# EAGLE design LichtschrankenArray (EAGLE 9.6.2)
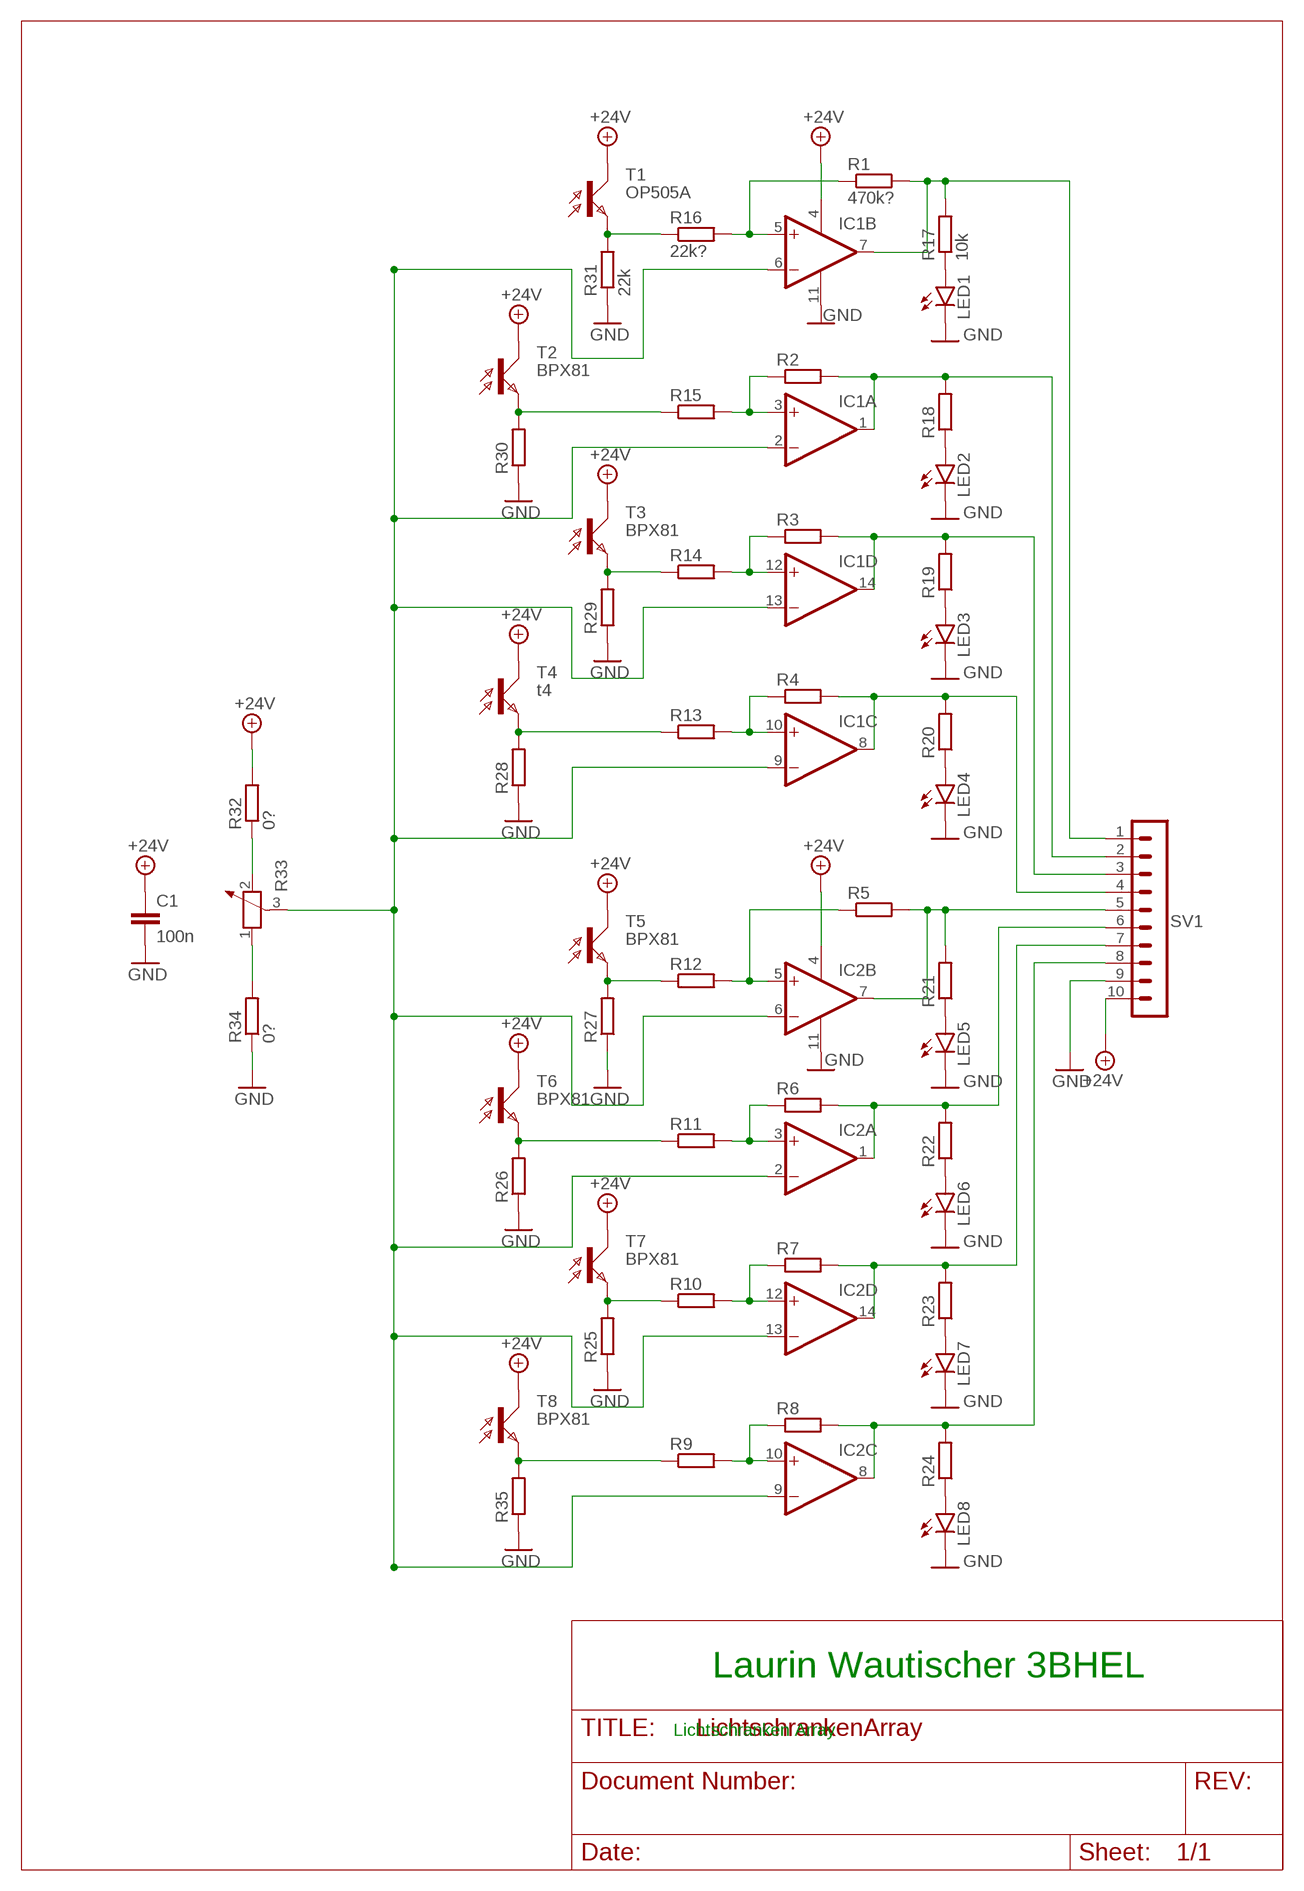
[diagram p0: schematic, sheet 1]

## Parts
C1  100n  C-EUC1206  [C1206]
IC1  4AMP_P4+11N  [DIL14]
IC2  4AMP_P4+11N  [DIL14]
LED1  LEDSMT1206  [1206]
LED2  LEDSMT1206  [1206]
LED3  LEDSMT1206  [1206]
LED4  LEDSMT1206  [1206]
LED5  LEDSMT1206  [1206]
LED6  LEDSMT1206  [1206]
LED7  LEDSMT1206  [1206]
LED8  LEDSMT1206  [1206]
R1  470k?  R-EU_0207/10  [0207/10]
R2  R-EU_0207/10  [0207/10]
R3  R-EU_0207/10  [0207/10]
R4  R-EU_0207/10  [0207/10]
R5  R-EU_0207/10  [0207/10]
R6  R-EU_0207/10  [0207/10]
R7  R-EU_0207/10  [0207/10]
R8  R-EU_0207/10  [0207/10]
R9  R-EU_R1206  [R1206]
R10  R-EU_R1206  [R1206]
R11  R-EU_R1206  [R1206]
R12  R-EU_R1206  [R1206]
R13  R-EU_R1206  [R1206]
R14  R-EU_R1206  [R1206]
R15  R-EU_R1206  [R1206]
R16  22k?  R-EU_R1206  [R1206]
R17  10k  R-EU_0207/10  [0207/10]
R18  R-EU_0207/10  [0207/10]
R19  R-EU_0207/10  [0207/10]
R20  R-EU_0207/10  [0207/10]
R21  R-EU_0207/10  [0207/10]
R22  R-EU_0207/10  [0207/10]
R23  R-EU_0207/10  [0207/10]
R24  R-EU_0207/10  [0207/10]
R25  R-EU_0207/10  [0207/10]
R26  R-EU_0207/10  [0207/10]
R27  R-EU_0207/10  [0207/10]
R28  R-EU_0207/10  [0207/10]
R29  R-EU_0207/10  [0207/10]
R30  R-EU_0207/10  [0207/10]
R31  22k  R-EU_0207/10  [0207/10]
R32  0?  R-EU_0207/10  [0207/10]
R33  POTENTIOMETER_PT-10  [PT-10]
R34  0?  R-EU_0207/10  [0207/10]
R35  R-EU_0207/10  [0207/10]
SV1  MA10-1  [MA10-1]
T1  OP505A  BPX81  [BPX81]
T2  BPX81  [BPX81]
T3  BPX81  [BPX81]
T4  t4  BPX81  [BPX81]
T5  BPX81  [BPX81]
T6  BPX81  [BPX81]
T7  BPX81  [BPX81]
T8  BPX81  [BPX81]

## Nets
+24V: C1.1 IC1.4(P:V+) IC2.4(P:V+) R32.2 SV1.10 T1.C T2.C T3.C T4.C T5.C T6.C T7.C T8.C
GND: C1.2 IC1.11(P:V-) IC2.11(P:V-) LED1.C LED2.C LED3.C LED4.C LED5.C LED6.C LED7.C LED8.C R25.1 R26.1 R27.1 R28.1 R29.1 R30.1 R31.1 R34.1 R35.1 SV1.9
N$1: IC1.5(B:+IN) R1.1 R16.2
N$2: IC2.5(B:+IN) R5.1 R12.2
N$3: IC1.7(B:OUT) R1.2 R17.2 SV1.1
N$4: LED1.A R17.1
N$5: LED2.A R18.1
N$6: IC1.3(A:+IN) R2.1 R15.2
N$7: IC1.1(A:OUT) R2.2 R18.2 SV1.2
N$8: LED3.A R19.1
N$9: IC1.12(D:+IN) R3.1 R14.2
N$10: IC1.14(D:OUT) R3.2 R19.2 SV1.3
N$11: LED4.A R20.1
N$12: IC1.10(C:+IN) R4.1 R13.2
N$13: IC1.8(C:OUT) R4.2 R20.2 SV1.4
N$14: LED5.A R21.1
N$15: LED6.A R22.1
N$16: IC2.3(A:+IN) R6.1 R11.2
N$17: IC2.1(A:OUT) R6.2 R22.2 SV1.6
N$18: LED7.A R23.1
N$19: IC2.12(D:+IN) R7.1 R10.2
N$20: IC2.14(D:OUT) R7.2 R23.2 SV1.7
N$21: LED8.A R24.1
N$22: IC2.10(C:+IN) R8.1 R9.2
N$23: IC2.8(C:OUT) R8.2 R24.2 SV1.8
N$24: IC2.7(B:OUT) R5.2 R21.2 SV1.5
N$26: R14.1 R29.2 T3.E
N$27: R12.1 R27.2 T5.E
N$28: R10.1 R25.2 T7.E
N$29: R9.1 R35.2 T8.E
N$31: R13.1 R28.2 T4.E
N$32: R15.1 R30.2 T2.E
N$33: R16.1 R31.2 T1.E
N$35: IC1.2(A:-IN) IC1.6(B:-IN) IC1.9(C:-IN) IC1.13(D:-IN) IC2.2(A:-IN) IC2.6(B:-IN) IC2.9(C:-IN) IC2.13(D:-IN) R33.3
N$36: R11.1 R26.2 T6.E
N$38: R32.1 R33.2
N$39: R33.1 R34.2

## Notes on the sheet
- Laurin Wautischer 3BHEL
- Lichtschranken Array

## Library data of the parts
C1 = rcl:C-EU: CAPACITOR, European symbol; SPICEPREFIX: C
IC1 IC2 = linear:4AMP_P4+11: OP AMP
LED1-LED8 = led:LED: LED OSRAM: - CHIPLED LG R971, LG N971, LY N971, LG Q971, LY Q971, LO R971, LY R971 LH N974, LH R974 LS Q976, LO Q976, LY Q976 LO Q996 - Hyper CHIPLED LW Q18S LB Q993, LB Q99A, LB R99A - SideLED LS A670, LO A670, LY A670, LG A670, LP A670 LB A673, LV A673, LT A673, LW A673 LH A674 LY A675 LS A676, LA A676, LO A676, LY A676, LW A676 LS A679, LY A679, LG A679 - Hyper Micro SIDELED® LS Y876, LA Y876, LO Y876, LY Y876 LT Y87S - SmartLED LW L88C, LW L88S LB L89C, LB L89S, LG L890 LS L89K, LO L89K, LY L89K LS L896, LA L896, LO L896, LY L896 - TOPLED LS T670, LO T670, LY T670, LG T670, LP T670 LSG T670, LSP T670, LSY T670, LOP T670, LYG T670 LG T671, LOG T671, LSG T671 LB T673, LV T673, LT T673, LW T673 LH T674 LS T676, LA T676, LO T676, LY T676, LB T676, LH T676, LSB T676, LW T676 LB T67C, LV T67C, LT T67C, LS T67K, LO T67K, LY T67K, LW E67C LS E67B, LA E67B, LO E67B, LY E67B, LB E67C, LV E67C, LT E67C LW T67C LS T679, LY T679, LG T679 LS T770, LO T770, LY T770, LG T770, LP T770 LB T773, LV T773, LT T773, LW T773 LH T774 LS E675, LA E675, LY E675, LS T675 LS T776, LA T776, LO T776, LY T776, LB T776 LHGB T686 LT T68C, LB T68C - Hyper Mini TOPLED® LB M676 - Mini TOPLED Santana® LG M470 LS M47K, LO M47K, LY M47K Source: http://www.osram.convergy.de LUXEON: - LUMILED® LXK2-PW12-R00, LXK2-PW12-S00, LXK2-PW14-U00, LXK2-PW14-V00 LXK2-PM12-R00, LXK2-PM12-S00, LXK2-PM14-U00 LXK2-PE12-Q00, LXK2-PE12-R00, LXK2-PE12-S00, LXK2-PE14-T00, LXK2-PE14-U00 LXK2-PB12-K00, LXK2-PB12-L00, LXK2-PB12-M00, LXK2-PB14-N00, LXK2-PB14-P00, LXK2-PB14-Q00 LXK2-PR12-L00, LXK2-PR12-M00, LXK2-PR14-Q00, LXK2-PR14-R00 LXK2-PD12-Q00, LXK2-PD12-R00, LXK2-PD12-S00 LXK2-PH12-R00, LXK2-PH12-S00 LXK2-PL12-P00, LXK2-PL12-Q00, LXK2-PL12-R00 Source: www.luxeon.com KINGBRIGHT: KA-3528ASYC Source: www.kingbright.com
R1-R32 R34 R35 = rcl:R-EU_: RESISTOR, European symbol; SPICEPREFIX: R
R33 = rcl:POTENTIOMETER_: Potentiometer; SPICEMODEL: POT; SPICEPREFIX: X
SV1 = con-lstb:MA10-1: PIN HEADER; OC_FARNELL: unknown; OC_NEWARK: unknown
T1-T8 = opto-trans-siemens:BPX81: PHOTO TRANSISTOR; OC_FARNELL: unknown; OC_NEWARK: unknown

## Board
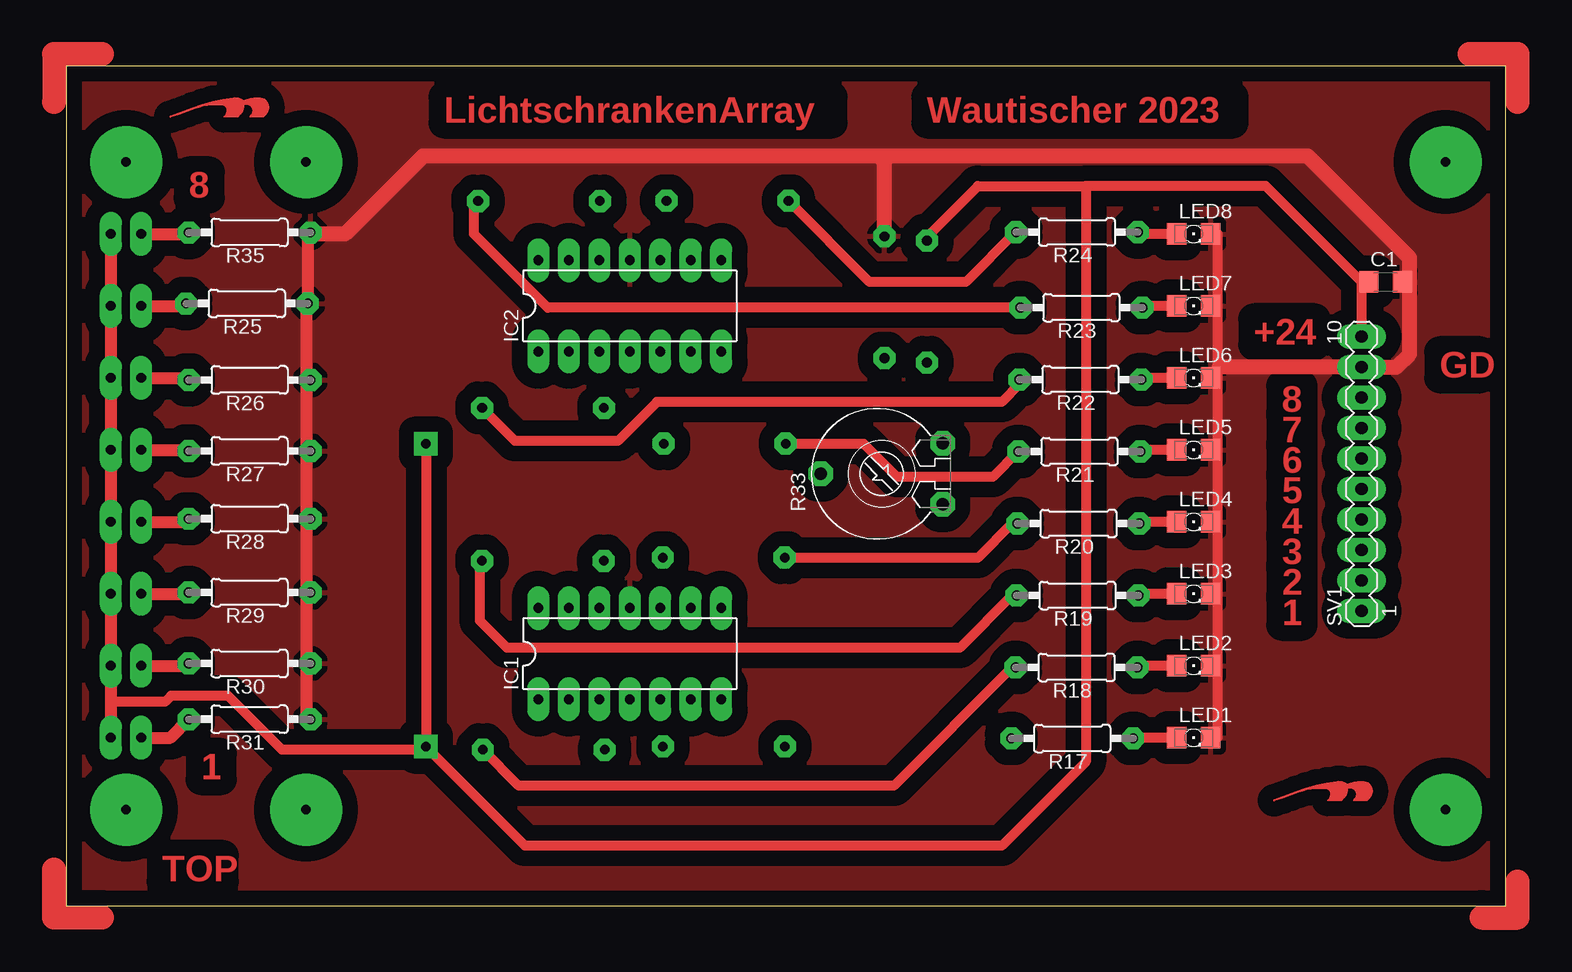
[diagram p1: board, top side]
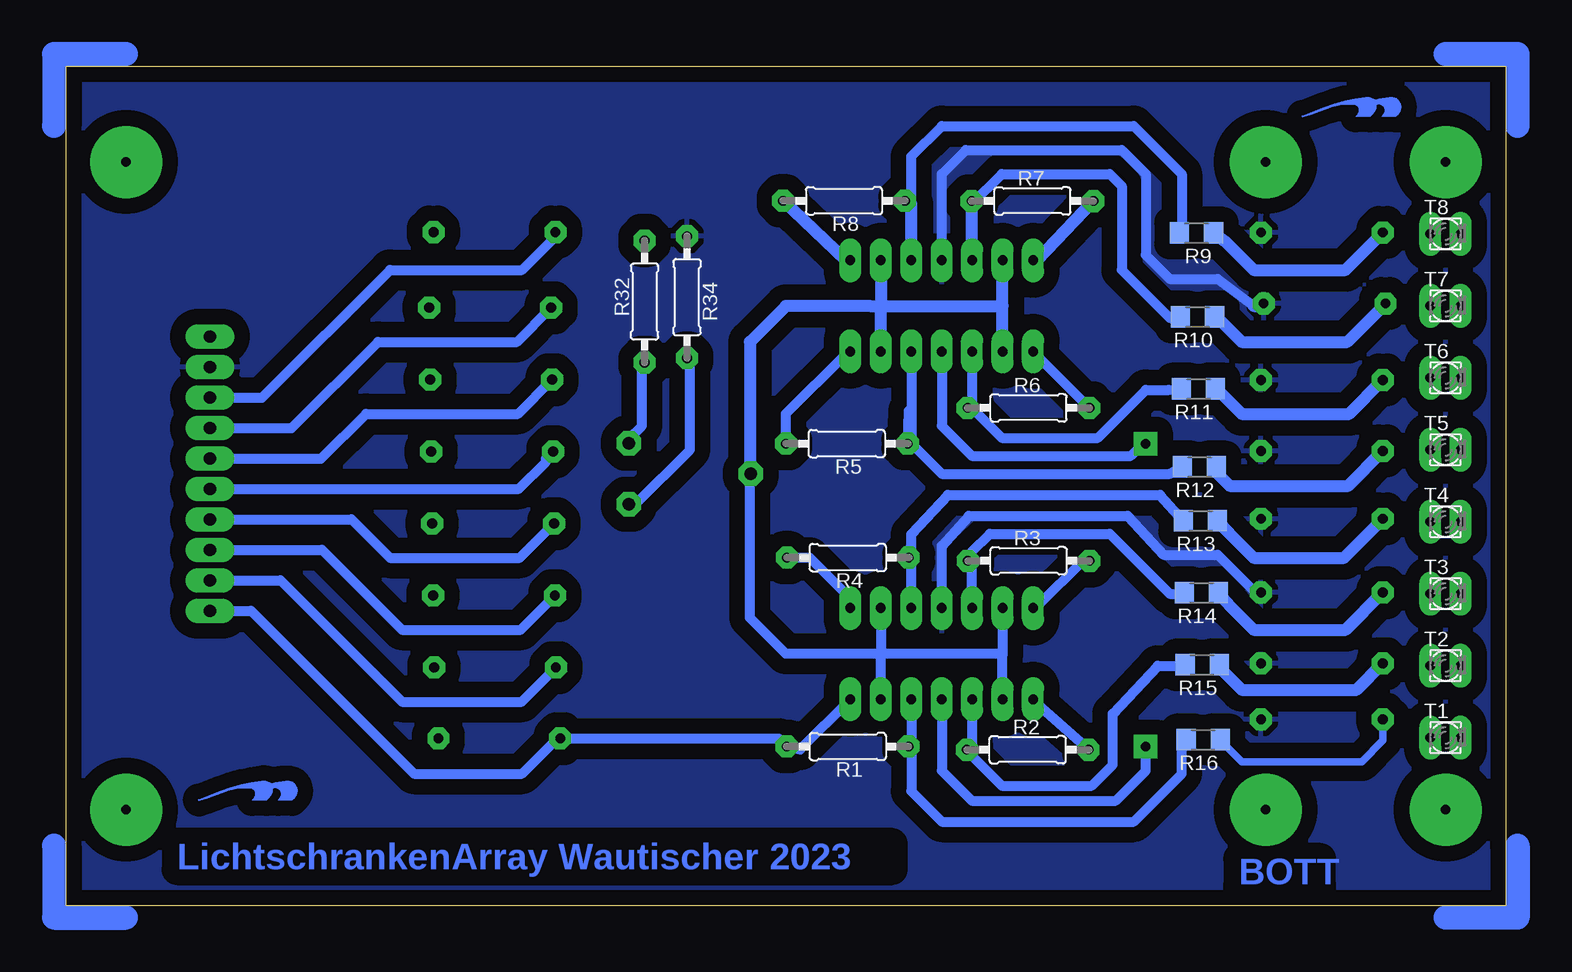
[diagram p2: board, bottom side, seen from below]

Size 120 x 70 mm. Coordinates in mm from the lower left corner, seen from the top.
Outline: 0,0 120,0 120,70 0,70 0,0
Copper layers (1*16): Top 0.035mm / dielectric 1.5mm / Bottom 0.035mm
Design rules "HTL-KLU-DRC *": minimum track width 16mil, minimum drill 31mil, track to track 16mil, track to pad 16mil, pad to pad 16mil, via to via 16mil, smd to smd 12mil, copper to edge 40mil, drill to drill 16mil, minimum pad ring 20mil, minimum via ring 16mil, stop-mask expansion 4mil, vias tented up to drill 0mil, thermal gap 20mil

### Footprints (pad centres in the part's own frame; a part is rotated, then mirrored left to right if it is on the bottom)
C1206 = smd 1.6 x 1.8: 1 -1.4,0; 2 1.4,0
DIL14 = drill 0.813 long: 1 -7.62,-3.81; 2 -5.08,-3.81; 3 -2.54,-3.81; 4 0,-3.81; 5 2.54,-3.81; 6 5.08,-3.81; 7 7.62,-3.81; 8 7.62,3.81; 9 5.08,3.81; 10 2.54,3.81; 11 0,3.81; 12 -2.54,3.81; 13 -5.08,3.81; 14 -7.62,3.81
1206 = smd 1.6 x 1.803: A -1.422,0; C 1.422,0
0207/10 = drill 0.813 octagon: 1 -5.08,0; 2 5.08,0
R1206 = smd 1.6 x 1.803: 1 -1.422,0; 2 1.422,0
PT-10 = drill 1.016 pad 1.778 octagon: 1 -2.54,-5.08; 2 2.54,-5.08; 3 0,5.08
MA10-1 = drill 1.016 long: 1 -11.43,0; 2 -8.89,0; 3 -6.35,0; 4 -3.81,0; 5 -1.27,0; 6 1.27,0; 7 3.81,0; 8 6.35,0; 9 8.89,0; 10 11.43,0
BPX81 = drill 0.813 long: C 1.27,0; E -1.27,0

### Placement (x,y rotation side)
C1  110,52 0 top
IC1  47,21 0 top
IC2  47,50 0 top
LED1  94,14 0 top
LED2  94,20 0 top
LED3  94,26 0 top
LED4  94,32 0 top
LED5  94,38 0 top
LED6  94,44 0 top
LED7  94,50 0 top
LED8  94,56 0 top
R1  54.84,13.26 180 bottom
R2  39.83,12.99 0 bottom
R3  39.75,28.74 0 bottom
R4  54.83,29.01 180 bottom
R5  54.91,38.51 180 bottom
R6  39.76,41.49 0 bottom
R7  39.43,58.74 0 bottom
R8  55.15,58.76 180 bottom
R9  25.76,56.07 180 bottom
R10  25.68,49.07 180 bottom
R11  25.6,43.07 180 bottom
R12  25.52,36.57 180 bottom
R13  25.44,32.07 180 bottom
R14  25.36,26.07 180 bottom
R15  25.28,20.07 180 bottom
R16  25.2,13.82 180 bottom
R17  83.88,13.93 180 top
R18  84.24,19.85 180 top
R19  84.32,25.85 180 top
R20  84.4,31.85 180 top
R21  84.48,37.85 180 top
R22  84.56,43.85 180 top
R23  84.64,49.85 180 top
R24  84.28,56.15 180 top
R25  15.08,50.2 180 top
R26  15.3,43.82 180 top
R27  15.3,37.9 180 top
R28  15.3,32.25 180 top
R29  15.3,26.1 180 top
R30  15.3,20.18 180 top
R31  15.3,15.53 180 top
R32  71.77,50.36 90 bottom
R33  68,36 90 top
R34  68.23,50.72 270 bottom
R35  15.3,56.12 180 top
SV1  108,36 90 top
T1  5,14 0 bottom
T2  5,20 0 bottom
T3  5,26 0 bottom
T4  5,32 0 bottom
T5  5,38 0 bottom
T6  5,44 0 bottom
T7  5,50 0 bottom
T8  5,56 0 bottom
U$1  [HTL-LOGO]  8,65 0 top
U$2  [HTL-LOGO]  100,8 0 top

### Tracks (layer width: path | path; a pad name or v marks a point on that pad's centre or on a via)
+24V  (via drill 0.8 pad 1.93)
  Top 0.813: v30,38.5 v30,13.25 | v30,13.25 30,13 18,13 13.5,17.5 8.75,17.5 8.25,17 3.73,17 | SV1.10 108,52 | 108,52 100,60 85,60 | 72,56 76,60 85,60 | 72,56 72,55.67 R32.2 71.77,55.77 72,56 | C1.1 108,52 | 85,60 85,12 78,5 38.25,5 v30,13.25
  Top 1.016: T8.C T7.C T6.C T5.C T4.C T3.C T2.C 3.73,17 T1.C
  Bottom 0.813: IC2.4 47,40 44.5,37.5 31.25,37.5 30.25,38.5 v30,38.5 | IC1.4 47,11.25 44.5,8.75 32.5,8.75 30,11.25 v30,13.25
GND
  Top 0.61: R27.1 20.1,37.9 20,38
  Top 0.813: 20.5,56 R35.1 | 96,45 96.11,44.89 95.42,44.2 LED6.C 96,44 | 96,45 96,50 | 96,50 96,56 LED8.C | LED7.C 96,50 | LED1.C 96,14 96,20 | 96,20 96,26 | 96,26 96,32 | 96,32 96,38 | 96,38 96,44 | 96,44 96,45 | LED5.C 96,38 | LED4.C 96,32 | LED3.C 96,26 | LED2.C 96,20 | C1.2 112,52
  Top 1.016: R35.1 20.16,56.12 R25.1 20,50.2 20,44 20.38,44 R26.1 20,43.82 20,38 20,32.25 | 20,32.25 20,26.1 | 20,26.1 20,20.18 | 20,20.18 20,15.75 20.38,15.5 R31.1 | R30.1 20,20.18 | R29.1 20,26.1 | R28.1 20,32.25
  Top 1.27: 20.5,56 23,56 23.25,56 29.75,62.5 67.75,62.5 | 96.11,44.89 SV1.9 110.89,44.89 112,46 112,52 112,54 103.5,62.5 67.75,62.5 | R34.1 68.23,62.02 67.75,62.5
  Bottom 0.813: IC2.11 47,61 45,63 32,63 30,61 30,54.25 28,52.25 24,52.25 21,50 | IC1.11 47,30 44.75,32.5 31.5,32.5 28.5,29.25 24,29.25 21,26.25 20.53,26.25 R29.1
  Bottom 1.016: R27.1 20,37.9 20,38 | 21,50 20.36,50 R25.1
  pour Bottom (isolate 1.3): 0,0 120,0 120,70 0,70
  pour Top (isolate 1.3): 0,0 120,0 120,70 0,70
N$1
  Bottom 0.813: R1.1 49.54,13.04 IC1.5 49.54,9.54 47,7 31,7 27,11 27,13.69 R16.2
N$2
  Bottom 0.813: IC2.5 49.54,40 | 49.54,40 49.54,38.54 47,36 28.01,36 R12.2 | R5.1 49.74,41.26 49.75,41 49.54,40
N$3
  Bottom 0.813: IC1.7 58.8,13.01 R1.2 60.59,13.93 R17.2 78.93,13.93 79,14 82,11 91,11 104.57,24.57 SV1.1
N$4
  Top 0.813: LED1.A 89.03,14 R17.1
N$5
  Top 0.813: LED2.A 89.47,20 R18.1
N$6
  Bottom 0.813: IC1.3 44.46,13 | 44.46,13 44.46,12.46 42,10 34.5,10 32.75,11.75 32.75,16 29,20 26.77,20 R15.2 | R2.1 44.47,12.99 44.46,13
N$7
  Top 0.813: R18.2 78.85,19.85 69,10 37.74,10 R2.2
  Bottom 0.813: IC1.1 39.38,17.12 R2.2 | SV1.2 102.11,27.11 92,17 82.01,17 R18.2
N$8
  Top 0.813: LED3.A 89.55,26 R19.1
N$9
  Bottom 0.813: IC1.12 44.46,29 | 44.46,29 44.46,29.54 43,31 33,31 28,26 26.85,26 R14.2 | R3.1 44.72,28.74 44.46,29
N$10
  Top 0.813: R19.2 78.85,25.85 74.5,21.5 36.75,21.5 34.5,23.75 34.5,28.57 R3.2
  Bottom 0.813: IC1.14 39.19,24.81 35,29 35,29.16 R3.2 | SV1.3 98.65,29.65 92,23 82.09,23 R19.2
N$11
  Top 0.813: LED4.A 89.63,32 R20.1
N$12
  Bottom 0.813: IC1.10 49.54,30 | 49.54,30 49.54,30.96 46.5,34.25 28.79,34.25 R13.2 | R4.1 49.55,30.01 49.54,30
N$13
  Top 0.813: R20.2 78.85,31.85 76,29 R4.2
  Bottom 0.813: IC1.8 54.62,25.62 58,29 R4.2 | SV1.4 96.19,32.19 93,29 82.17,29 R20.2
N$14
  Top 0.813: LED5.A 89.71,38 R21.1
N$15
  Top 0.813: LED6.A 89.79,44 R22.1
N$16
  Bottom 0.813: IC2.3 44.46,41.46 | 44.46,41.46 42,39 34,39 30,43 28.09,43 R11.2 | R6.1 44.49,41.49 44.46,41.46
N$17
  Top 0.813: R22.2 79.48,43.48 78,42 49.25,42 46,38.75 37.42,38.75 R6.2
  Bottom 0.813: R6.2 IC2.1 | SV1.6 98.73,37.27 95,41 82.33,41 R22.2
N$18
  Top 0.813: LED7.A 89.87,50 R23.1
N$19
  Bottom 0.813: 44.46,58.54 42,61 33,61 32,60 32,53 28,49 27.17,49 R10.2
  Bottom 1.016: IC2.12 44.46,58.54 R7.1
N$20
  Top 0.813: R23.2 40.15,49.85 34,56 34,58.39 R7.2
  Bottom 0.813: SV1.7 101.19,39.81 94,47 82.41,47 R23.2
  Bottom 1.016: IC2.14 39.03,53.81 R7.2
N$21
  Top 0.813: LED8.A 89.51,56 R24.1
N$22
  Bottom 0.813: IC2.10 49.54,62.46 47,65 31,65 27,61 27,56.25 R9.2
  Bottom 1.016: IC2.10 49.54,58.48 R8.1
N$23
  Top 0.813: R24.2 79.15,56.15 75,52 66.99,52 R8.2
  Bottom 0.813: SV1.8 103.65,42.35 93,53 82,53 79,56 79.05,56 R24.2
  Bottom 1.016: IC2.8 55.03,53.81 R8.2
N$24
  Top 0.813: R21.2 79.35,37.85 77.25,35.75 69.25,35.75 66.5,38.5 R5.2
  Bottom 0.813: R5.2 59.99,41.01 55,46 54.81,46 IC2.7 | SV1.5 82.27,34.73 80,37 80,37.25 R21.2
N$25
  Bottom 2: -1,65 -1,71 5,71
N$26
  Top 1.016: T3.E 10.22,26 R29.2
  Bottom 1.016: R14.1 22.94,24.94 21,23 13.32,23 R29.2
N$27
  Top 1.016: T5.E 10.22,38 R27.2
  Bottom 1.016: R12.1 24.1,36.1 23,35 13.12,35 R27.2
N$28
  Top 1.016: T7.E 10,50 R25.2
  Bottom 1.016: R10.1 24.26,49.26 22,47 13.2,47 R25.2
N$29
  Top 1.016: T8.E 10.22,56 R35.2
  Bottom 1.016: R9.1 23.34,55.34 21,53 13.34,53 R35.2
N$30
  Bottom 2: 115,71 121,71 121,65
N$31
  Top 1.016: T4.E 10.22,32 R28.2
  Bottom 1.016: R13.1 23.02,31.02 21,29 13.47,29 R28.2
N$32
  Top 1.016: T2.E 10.22,20 R30.2
  Bottom 1.016: R15.1 23.86,19.86 22,18 12.4,18 R30.2
N$33
  Top 1.016: T1.E 8.72,14 R31.2
  Bottom 0.61: R31.2 10.22,13.78 12,12 22,12 23.5,13.5 23.75,14.04 R16.1
N$34
  Bottom 2: 121,5 121,-1 115,-1
N$35
  Bottom 0.813: IC1.13 41.92,21.08 42,21 | 42,21 52,21 | 52,21 60,21 63,24 63,35.92 R33.3 | IC1.2 41.92,20.92 42,21 | IC1.6 52.08,20.92 52,21 | IC1.9 52.08,21.08 52,21
  Bottom 1.016: IC2.2 41.92,50 | 41.92,50 IC2.13 | IC2.6 52.08,49.92 | 52.08,49.92 52,50 41.92,50 | IC2.9 52.08,49.92 | 52.08,49.92 53,50 | 53,50 60,50 63,47 63,36.08 R33.3 | 53,50 52.16,50 52.08,49.92
N$36
  Top 1.016: T6.E 10.22,44 R26.2
  Bottom 1.016: R11.1 24.07,43.07 22,41 13.04,41 R26.2
N$37
  Bottom 2: -1,5 -1,-1 5,-1
N$38
  Bottom 0.813: R33.2 73.08,38.92 72,40 72,45.05 R32.1
N$39
  Bottom 0.813: R33.1 72.54,33.46 68,38 68,45.41 R34.2
N$40  (via drill 0.8 pad 6)
  other vias: 5,62
N$41  (via drill 0.8 pad 6)
  other vias: 20,62
N$42  (via drill 0.8 pad 6)
  other vias: 20,8
N$43  (via drill 0.8 pad 6)
  other vias: 5,8
N$44  (via drill 0.8 pad 6)
  other vias: 115,8
N$45  (via drill 0.8 pad 6)
  other vias: 115,62
N$46
  Top 2: 3,-1 -1,-1 -1,3
N$47
  Top 2: 118,-1 121,-1 121,2
N$48
  Top 2: 121,67 121,71 117,71
N$49
  Top 2: 3,71 -1,71 -1,67

### Text on the board
Top: LichtschrankenArray | Wautischer 2023 | 8 | +24 | GD | 8 | 7 | 6 | 5 | 4 | 3 | 2 | 1 | 1 | TOP
Bottom: LichtschrankenArray Wautischer 2023 | BOTT